# EasyEDA Pro project PicoMiteVGAV1.0.eprj, schematic Schematic1
Create Date: 2023-03-16; Page Name: P1; Project Name: PicoMiteVGAV1.0; Schematic Name: Schematic1; Update Date: 2023-04-25; Company: EasyEDA.com; Drawed: Peter Mather; Page Size: A4; Part Number: JLCPCB-002; Reviewed: Peter Mather; Version: V0.1
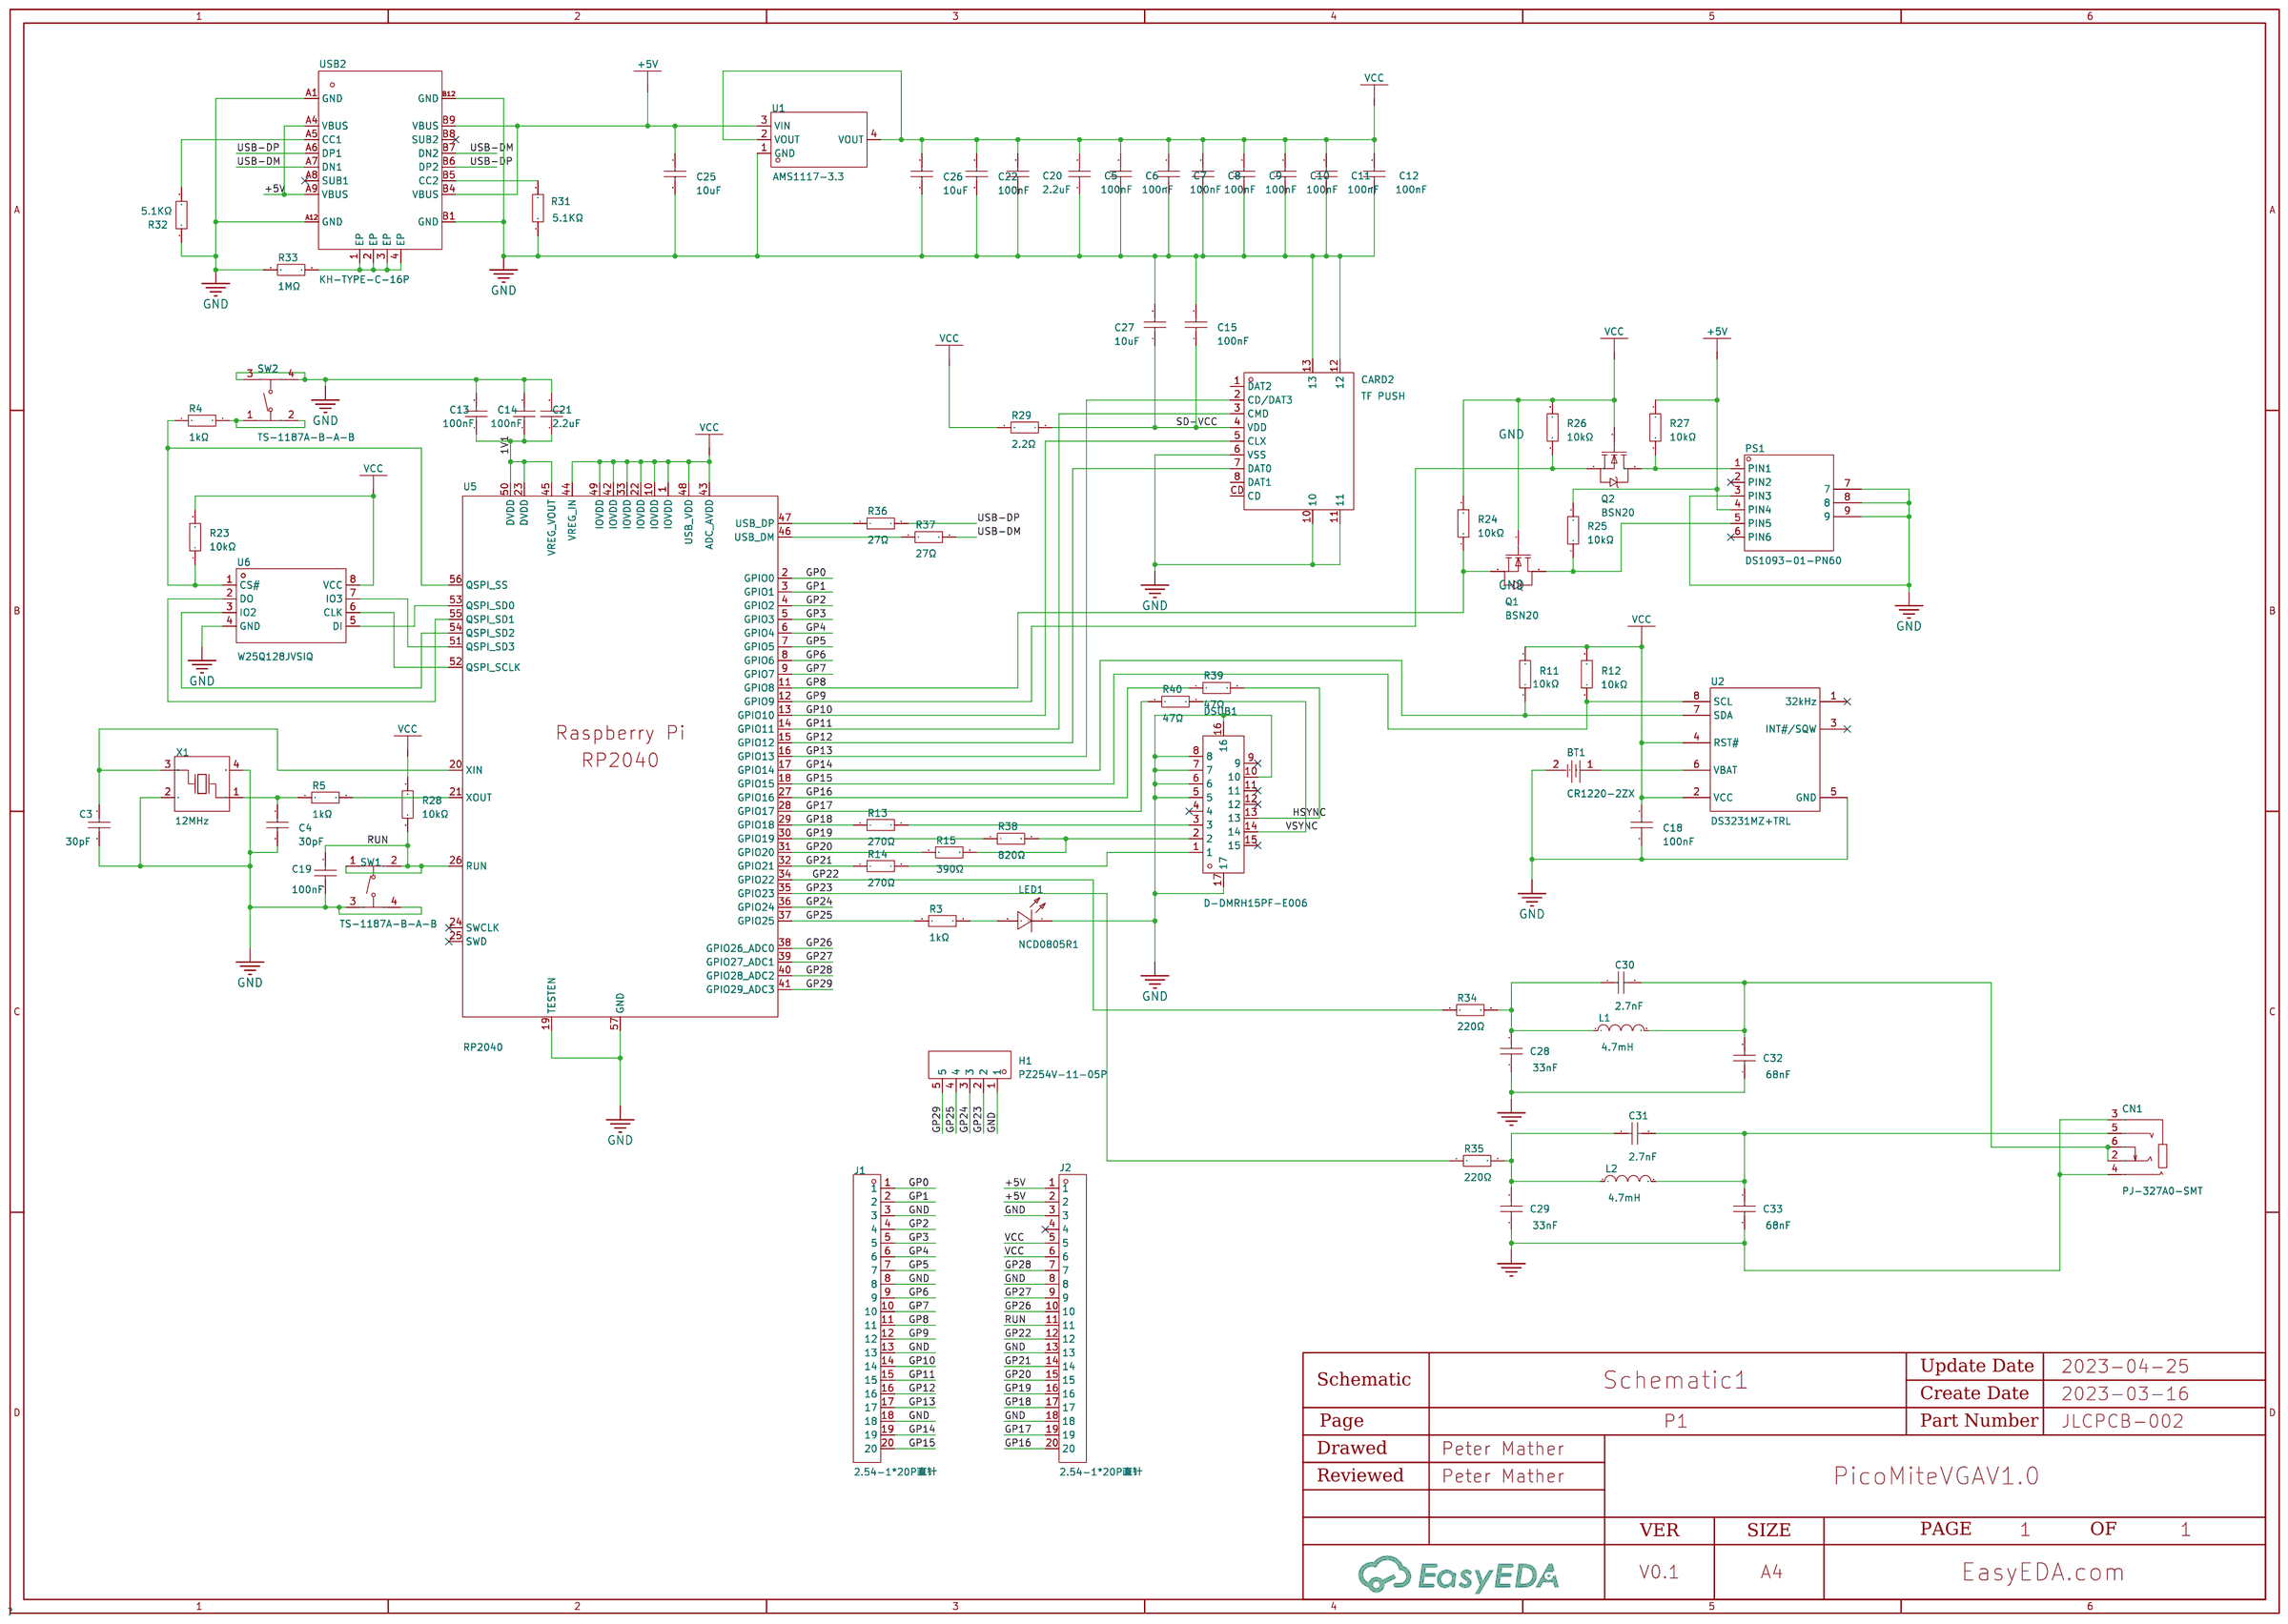
[diagram p0: schematic sheet]

## Parts
BT1  CR1220-2ZX  [BAT-SMD_CR1220-2ZX]
C3  30pF  [C0402]
C4  30pF  [C0402]
C5  100nF  [C0402_NEW]
C6  100nF  [C0402_NEW]
C7  100nF  [C0402_NEW]
C8  100nF  [C0402_NEW]
C9  100nF  [C0402_NEW]
C10  100nF  [C0402_NEW]
C11  100nF  [C0402_NEW]
C12  100nF  [C0402_NEW]
C13  100nF  [C0402_NEW]
C14  100nF  [C0402_NEW]
C15  100nF  [C0402_NEW]
C18  100nF  [C0402_NEW]
C19  100nF  [C0402_NEW]
C20  2.2uF  [C0603]
C21  2.2uF  [C0603]
C22  100nF  [C0402_NEW]
C25  10uF  [C1206]
C26  10uF  [C1206]
C27  10uF  [C1206]
C28  33nF  [C0603]
C29  33nF  [C0603]
C30  2.7nF  [C0603]
C31  2.7nF  [C0603]
C32  68nF  [C0603]
C33  68nF  [C0603]
CARD2  TF PUSH  [TF-SMD_TF-PUSH]
CN1  PJ-327A0-SMT  [AUDIO-SMD_PJ-327A0-SMT]
DSUB1  D-DMRH15PF-E006  [DSUB-TH_15P-P2.29-H-F_DDMRH15PFE006]
H1  PZ254V-11-05P  [HDR-TH_5P-P2.54-V-M]
J1  2.54-1*20P直针  [HDR-TH_20P-P2.54-V-M-1]
J2  2.54-1*20P直针  [HDR-TH_20P-P2.54-V-M-1]
L1  4.7mH  [IND-SMD_L6.0-W6.0]
L2  4.7mH  [IND-SMD_L6.0-W6.0]
LED1  NCD0805R1  [LED0805-RD]
PS1  DS1093-01-PN60  [CONN-TH_DS1093-01-PN60]
Q1  BSN20  [SOT-23-3_L2.9-W1.6-P1.90-LS2.8-BR]
Q2  BSN20  [SOT-23-3_L2.9-W1.6-P1.90-LS2.8-BR]
R3  1kΩ  [R0603]
R4  1kΩ  [R0603]
R5  1kΩ  [R0603]
R11  10kΩ  [R0805]
R12  10kΩ  [R0805]
R13  270Ω  [R0603]
R14  270Ω  [R0603]
R15  390Ω  [R0603]
R23  10kΩ  [R0402]
R24  10kΩ  [R0402]
R25  10kΩ  [R0402]
R26  10kΩ  [R0402]
R27  10kΩ  [R0402]
R28  10kΩ  [R0402]
R29  2.2Ω  [R0805]
R31  5.1kΩ  [R0402]
R32  5.1kΩ  [R0402]
R33  1MΩ  [R0402]
R34  220Ω  [R0603]
R35  220Ω  [R0603]
R36  27Ω  [R0603]
R37  27Ω  [R0603]
R38  820Ω  [R0603]
R39  47Ω  [R0805]
R40  47Ω  [R0805]
SW1  TS-1187A-B-A-B  [SW-SMD_4P-L5.1-W5.1-P3.70-LS6.5-TL-2]
SW2  TS-1187A-B-A-B  [SW-SMD_4P-L5.1-W5.1-P3.70-LS6.5-TL-2]
U1  AMS1117-3.3  [SOT-223-3_L6.5-W3.4-P2.30-LS7.0-BR]
U2  DS3231MZ+TRL  [SOIC-8_L4.9-W3.9-P1.27-LS6.0-BL]
U5  RP2040  [LQFN-56_L7.0-W7.0-P0.4-EP]
U6  W25Q128JVSIQ  [SOIC-8_L5.3-W5.3-P1.27-LS8.0-BL]
USB2  KH-TYPE-C-16P  [USB-C-SMD_KH-TYPE-C-16P]
X1  12MHz  [OSC-SMD_4P-L3.2-W2.5-BL]

## Library data of the parts
BT1 = CR1220-2ZX: Connector Type:Battery base Battery Type:CR1220 Operating Temperature Range:-25℃~+85℃ Operating Temperature Range:-25℃~+85℃; LCSC Part Name: 电池底座 适用电池:CR1220 自吸; Supplier Part: C969906; Manufacturer: Q&J; Supplier Footprint: SMD; JLCPCB Part Class: Extended Part; Datasheet: https://atta.szlcsc.com/upload/public/pdf/source/20210107/C969906_C1D85B5C66CBBA4D1AEB8467FE1CEC7A.pdf; Supplier: LCSC; Connector Type: Battery base; Battery Type: CR1220; Operating Temperature Range: -25℃~+85℃
C3 C4 = 0402CG300J500NT: Capacitance: Tolerance:±5% Tolerance:±5% Voltage Rated: Temperature Coefficient:; LCSC Part Name: 30pF ±5% 50V; Supplier Part: C1570; Manufacturer: FH(风华); Supplier Footprint: 0402; JLCPCB Part Class: Basic Part; Datasheet: https://atta.szlcsc.com/upload/public/pdf/source/20170923/C1570_1506149275948988377.pdf; Supplier: LCSC; Tolerance: ±5%
C5-C15 C18 C19 C22 = CL05B104KO5NNNC: Capacitance: Tolerance:±10% Tolerance:±10% Voltage Rated: Temperature Coefficient:; LCSC Part Name: 100nF ±10% 16V; Supplier Part: C1525; Manufacturer: SAMSUNG(三星); Supplier Footprint: 0402; JLCPCB Part Class: Basic Part; Datasheet: https://atta.szlcsc.com/upload/public/pdf/source/20160103/1457707674891.pdf; Supplier: LCSC; Tolerance: ±10%
C20 C21 = CL10A225KO8NNNC: Capacitance: Tolerance:±10% Tolerance:±10% Voltage Rated: Temperature Coefficient:; LCSC Part Name: 2.2uF ±10% 16V; Supplier Part: C23630; Manufacturer: SAMSUNG(三星); Supplier Footprint: 0603; JLCPCB Part Class: Basic Part; Datasheet: https://atta.szlcsc.com/upload/public/pdf/source/20160103/1457707709512.pdf; Supplier: LCSC; Tolerance: ±10%
C25-C27 = CL31A106KBHNNNE: Capacitance: Tolerance:±10% Tolerance:±10% Voltage Rated: Temperature Coefficient:; LCSC Part Name: 10uF ±10% 50V; Supplier Part: C13585; Manufacturer: SAMSUNG(三星); Supplier Footprint: 1206; JLCPCB Part Class: Basic Part; Datasheet: https://atta.szlcsc.com/upload/public/pdf/source/20160103/1457707668742.pdf; Supplier: LCSC; Tolerance: ±10%
C28 C29 = CL10B333KB8NNNC: Capacitance: Tolerance:±10% Tolerance:±10% Voltage Rated: Temperature Coefficient:; LCSC Part Name: 33nF ±10% 50V; Supplier Part: C21117; Manufacturer: SAMSUNG(三星); Supplier Footprint: 0603; JLCPCB Part Class: Basic Part; Datasheet: https://atta.szlcsc.com/upload/public/pdf/source/20160103/1457707704657.pdf; Supplier: LCSC; Tolerance: ±10%
C30 C31 = 0603B272K500NT: Capacitance: Tolerance:±10% Tolerance:±10% Voltage Rated: Temperature Coefficient:; LCSC Part Name: 2.7nF ±10% 50V; Supplier Part: C1609; Manufacturer: FH(风华); Supplier Footprint: 0603; JLCPCB Part Class: Basic Part; Datasheet: https://atta.szlcsc.com/upload/public/pdf/source/20170923/C1609_1506149290824988408.pdf; Supplier: LCSC; Tolerance: ±10%
C32 C33 = CL10B683KB8NNNC: Capacitance: Tolerance:±10% Tolerance:±10% Voltage Rated: Temperature Coefficient:; LCSC Part Name: 68nF ±10% 50V; Supplier Part: C31658; Manufacturer: SAMSUNG(三星); Supplier Footprint: 0603; JLCPCB Part Class: Basic Part; Datasheet: https://atta.szlcsc.com/upload/public/pdf/source/20160103/1457707721348.pdf; Supplier: LCSC; Tolerance: ±10%
CARD2 = TF PUSH: Card Type:MicroSD卡(TF卡) Connector Type:卡座 Card Connection Mode:自弹式 Maximum Body Height:2mm Operating Temperature Range:-20℃~+90℃ Operating Temperature Range:-20℃~+90℃; LCSC Part Name: 自弹式TF卡座 TF外焊式内存卡卡座; Supplier Part: C393941; Manufacturer: SHOU HAN(首韩); Supplier Footprint: SMD; JLCPCB Part Class: Extended Part; Datasheet: https://atta.szlcsc.com/upload/public/pdf/source/20191011/C393941_0DDD896EE907FEB750D8B7B8982E2A67.pdf; Supplier: LCSC; Card Type: MicroSD卡(TF卡); Connector Type: 卡座; Card Connection Mode: 自弹式; Maximum Body Height: 2mm; Operating Temperature Range: -20℃~+90℃
CN1 = PJ-327A0-SMT: Connector Type:3.5mm耳机座 Current Rating (Max):0.5A Voltage Rating (Max):30V Operating Temperature Range:-20℃~+70℃ Operating Temperature Range:-20℃~+70℃ Welding Temperature (Max):235℃; LCSC Part Name: 3.5mm耳机座 5P镀金; Supplier Part: C381135; Manufacturer: XKB Connectivity(中国星坤); Supplier Footprint: SMD; JLCPCB Part Class: Extended Part; Datasheet: https://atta.szlcsc.com/upload/public/pdf/source/20211011/16B83D74DCFBFB52BBA1016D248FDA16.pdf; Supplier: LCSC; Connector Type: 3.5mm耳机座; Current Rating (Max): 0.5A; Voltage Rating (Max): 30V; Operating Temperature Range: -20℃~+70℃; Welding Temperature (Max): 235℃
DSUB1 = D-DMRH15PF-E006: Connector Type:D-Sub Gender:Female Number of Pins:15 Number of Rows:3 Mounting Style:Shrouded Current Rating (Max):3A Operating Temperature Range:-50℃~+105℃ Operating Temperature Range:-50℃~+105℃; LCSC Part Name: D-Sub 母 P数:15 HDR半金 铆合锁螺丝 黑胶芯三排; Supplier Part: C379814; Manufacturer: Ckmtw(灿科盟); Supplier Footprint: 插件; JLCPCB Part Class: Extended Part; Datasheet: https://atta.szlcsc.com/upload/public/pdf/source/20190517/C379814_DEECC6016DAC8F179B4364792A838A7A.pdf; Supplier: LCSC; Connector Type: D-Sub; Gender: Female; Number of Pins: 15; Number of Rows: 3; Mounting Style: Shrouded; Current Rating (Max): 3A; Operating Temperature Range: -50℃~+105℃
H1 = PZ254V-11-05P: Number of Rows:单排 Number of Pins:5 Pitch:2.54mm Pin Structure:1x5P Row Spacing:- Mounting Type:Straight Circluar Pins/Square Pins:Square Pins Current Rating (Max):- Voltage Rating (Max):- Length of Mating Pin:6mm Insulation Height:2.5mm Length of End Conn; LCSC Part Name: 2.54mm 1x5P 直插 方针; Supplier Part: C492404; Manufacturer: XFCN(兴飞); Supplier Footprint: 插件,P=2.54mm; JLCPCB Part Class: Extended Part; Datasheet: https://atta.szlcsc.com/upload/public/pdf/source/20200309/C492404_E51533260F8710EFF5D4617281164C1D.pdf; Supplier: LCSC; Number of Rows: 单排; Number of Pins: 5; Pitch: 2.54mm; Pin Structure: 1x5P; Mounting Type: Straight; Circluar Pins/Square Pins: Square Pins; Length of Mating Pin: 6mm; Insulation Height: 2.5mm; Length of End Connection Pin: 3mm; Operating Temperature Range: -40℃~+105℃; Color: Black
J1 J2 = 2.54-1*20P直针: Number of Rows:单排 Number of Pins:20 Pitch:2.54mm Pin Structure:1x20P Row Spacing:- Mounting Type:Straight Circluar Pins/Square Pins:Square Pins Current Rating (Max):3A Voltage Rating (Max):- Length of Mating Pin:- Insulation Height:- Length of End Connect; LCSC Part Name: 2.54mm 1x20P 直插 方针; Supplier Part: C50981; Manufacturer: BOOMELE(博穆精密); Supplier Footprint: 插件,P=2.54mm; JLCPCB Part Class: Extended Part; Datasheet: https://atta.szlcsc.com/upload/public/pdf/source/20151109/1457707571495.pdf; Supplier: LCSC; Number of Rows: 单排; Number of Pins: 20; Pitch: 2.54mm; Pin Structure: 1x20P; Mounting Type: Straight; Circluar Pins/Square Pins: Square Pins; Current Rating (Max): 3A; Operating Temperature Range: -40℃~+105℃; Color: Black
L1 L2 = YNR6045-472M: Inductance: Tolerance: Tolerance: Rated Current: DC Resistance (DCR):; LCSC Part Name: 4.7mH ±20% 120mA 19.75Ω; Supplier Part: C497846; Manufacturer: YJYCOIN(益嘉源); Supplier Footprint: SMD,6x6mm; JLCPCB Part Class: Extended Part; Datasheet: https://atta.szlcsc.com/upload/public/pdf/source/20200317/C497838_ADAADDA66AFC043F2D8B9A62FB946728.pdf; Supplier: LCSC
LED1 = NCD0805R1_C84256: Emitted Color:红灯; LCSC Part Name: 红灯; Supplier Part: C84256; Manufacturer: 国星光电; Supplier Footprint: 0805; JLCPCB Part Class: Basic Part; Datasheet: https://atta.szlcsc.com/upload/public/pdf/source/20200820/C84256_F0A75A43B3EAD75808600A0514C76B99.pdf; Supplier: LCSC; Emitted Color: 红灯
PS1 = DS1093-01-PN60: Number of Pins:6 Gender:Female Level of Protection:- Current Rating (Max):1A Operating Temperature Range:-40℃~+105℃ Operating Temperature Range:-40℃~+105℃; LCSC Part Name: PS2鼠标插座 6Pin  紫色; Supplier Part: C77848; Manufacturer: CONNFLY; Supplier Footprint: 插件; JLCPCB Part Class: Extended Part; Datasheet: https://atta.szlcsc.com/upload/public/pdf/source/20160816/1471343007546.pdf; Supplier: LCSC; Number of Pins: 6; Gender: Female; Current Rating (Max): 1A; Operating Temperature Range: -40℃~+105℃
Q1 Q2 = BSN20_C116157: Type: Drain Source Voltage (Vdss): Continuous Drain Current (Id): Power Dissipation (Pd):- Drain Source On Resistance (RDS(on)@Vgs,Id):3.5Ω@5V,200mA Gate Threshold Voltage (Vgs(th)@Id):1.5V@1mA; LCSC Part Name: N沟道 50V 100mA; Supplier Part: C116157; Manufacturer: SHIKUES(时科); Supplier Footprint: SOT-23-3L; JLCPCB Part Class: Extended Part; Datasheet: https://atta.szlcsc.com/upload/public/pdf/source/20170721/C116157_1500622630262834583.pdf; Supplier: LCSC; Drain Source On Resistance (RDS(on)@Vgs,Id): 3.5Ω@5V,200mA; Gate Threshold Voltage (Vgs(th)@Id): 1.5V@1mA
R3-R5 = 0603WAF1001T5E: Type:Thick Film Resistors Resistance: Tolerance:±1% Tolerance:±1% Power(Watts): Temperature Coefficient:±100ppm/℃ Temperature Coefficient:±100ppm/℃ Overload Voltage (Max): Operating Temperature Range:-55℃~+155℃ Operating Temperature Range:-55℃~+155℃; LCSC Part Name: 1kΩ ±1% 100mW; Supplier Part: C21190; Manufacturer: UNI-ROYAL(厚声); Supplier Footprint: 0603; JLCPCB Part Class: Basic Part; Datasheet: https://atta.szlcsc.com/upload/public/pdf/source/20200306/C422600_1E6D84923E4A46A82E41ADD87F860B5C.pdf; Supplier: LCSC; Type: Thick Film Resistors; Tolerance: ±1%; Temperature Coefficient: ±100ppm/℃; Operating Temperature Range: -55℃~+155℃
R11 R12 = 0805W8F1002T5E: Type:Thick Film Resistors Resistance: Tolerance:±1% Tolerance:±1% Power(Watts): Temperature Coefficient:±100ppm/℃ Temperature Coefficient:±100ppm/℃ Overload Voltage (Max): Operating Temperature Range:-55℃~+155℃ Operating Temperature Range:-55℃~+155℃; LCSC Part Name: 10kΩ ±1% 125mW; Supplier Part: C17414; Manufacturer: UNI-ROYAL(厚声); Supplier Footprint: 0805; JLCPCB Part Class: Basic Part; Datasheet: https://atta.szlcsc.com/upload/public/pdf/source/20200306/C422600_1E6D84923E4A46A82E41ADD87F860B5C.pdf; Supplier: LCSC; Type: Thick Film Resistors; Tolerance: ±1%; Temperature Coefficient: ±100ppm/℃; Operating Temperature Range: -55℃~+155℃
R13 R14 = 0603WAF2700T5E: Type:Thick Film Resistors Resistance: Tolerance:±1% Tolerance:±1% Power(Watts): Temperature Coefficient:±100ppm/℃ Temperature Coefficient:±100ppm/℃ Overload Voltage (Max): Operating Temperature Range:-55℃~+155℃ Operating Temperature Range:-55℃~+155℃; LCSC Part Name: 270Ω ±1% 100mW; Supplier Part: C22966; Manufacturer: UNI-ROYAL(厚声); Supplier Footprint: 0603; JLCPCB Part Class: Basic Part; Datasheet: https://atta.szlcsc.com/upload/public/pdf/source/20200306/C422600_1E6D84923E4A46A82E41ADD87F860B5C.pdf; Supplier: LCSC; Type: Thick Film Resistors; Tolerance: ±1%; Temperature Coefficient: ±100ppm/℃; Operating Temperature Range: -55℃~+155℃
R15 = 0603WAF3900T5E: Tolerance: Temperature Coefficient: Temperature Coefficient: Power(Watts): Resistance: Overload Voltage (Max): Operating Temperature Range: Operating Temperature Range:; LCSC Part Name: 390Ω ±1%; Supplier Part: C23151; Manufacturer: UNI-ROYAL(厚声); Supplier Footprint: 0603; JLCPCB Part Class: Basic Part; Datasheet: https://atta.szlcsc.com/upload/public/pdf/source/20170920/C23151_1505901103965982535.pdf; Supplier: LCSC
R23-R28 = 0402WGF1002TCE: Type:Thick Film Resistors Resistance: Tolerance:±1% Tolerance:±1% Power(Watts): Temperature Coefficient:±100ppm/℃ Temperature Coefficient:±100ppm/℃ Overload Voltage (Max): Operating Temperature Range:-55℃~+155℃ Operating Temperature Range:-55℃~+155℃; LCSC Part Name: 10kΩ ±1% 62.5mW; Supplier Part: C25744; Manufacturer: UNI-ROYAL(厚声); Supplier Footprint: 0402; JLCPCB Part Class: Basic Part; Datasheet: https://atta.szlcsc.com/upload/public/pdf/source/20200306/C422600_1E6D84923E4A46A82E41ADD87F860B5C.pdf; Supplier: LCSC; Type: Thick Film Resistors; Tolerance: ±1%; Temperature Coefficient: ±100ppm/℃; Operating Temperature Range: -55℃~+155℃
R29 = 0805W8F220KT5E: LCSC Part Name: 2.2Ω(2R20) ±1% 编带; Supplier Part: C17521; Manufacturer: UNI-ROYAL(厚声); Supplier Footprint: 0805; JLCPCB Part Class: Basic Part; Datasheet: https://atta.szlcsc.com/upload/public/pdf/source/20170920/C17521_1505887118343979880.pdf; Supplier: LCSC
R31 R32 = 0402WGF5101TCE: Type:Thick Film Resistors Resistance: Tolerance:±1% Tolerance:±1% Power(Watts): Temperature Coefficient:±100ppm/℃ Temperature Coefficient:±100ppm/℃ Overload Voltage (Max): Operating Temperature Range:-55℃~+155℃ Operating Temperature Range:-55℃~+155℃; LCSC Part Name: 5.1KΩ(5101) ±1% 编带; Supplier Part: C25905; Manufacturer: UNI-ROYAL(厚声); Manufacturer Part: 5.1KΩ; Supplier Footprint: 0402; JLCPCB Part Class: Basic Part; Datasheet: https://atta.szlcsc.com/upload/public/pdf/source/20170920/C25905_1505895107382980911.pdf; Supplier: LCSC; Type: Thick Film Resistors; Tolerance: ±1%; Temperature Coefficient: ±100ppm/℃; Operating Temperature Range: -55℃~+155℃
R33 = 0402WGF1004TCE: Type:Thick Film Resistors Resistance: Tolerance:±1% Tolerance:±1% Power(Watts): Temperature Coefficient:±100ppm/℃ Temperature Coefficient:±100ppm/℃ Overload Voltage (Max): Operating Temperature Range:-55℃~+155℃ Operating Temperature Range:-55℃~+155℃; LCSC Part Name: 1MΩ ±1% 62.5mW; Supplier Part: C26083; Manufacturer: UNI-ROYAL(厚声); Supplier Footprint: 0402; JLCPCB Part Class: Basic Part; Datasheet: https://atta.szlcsc.com/upload/public/pdf/source/20200306/C422600_1E6D84923E4A46A82E41ADD87F860B5C.pdf; Supplier: LCSC; Type: Thick Film Resistors; Tolerance: ±1%; Temperature Coefficient: ±100ppm/℃; Operating Temperature Range: -55℃~+155℃
R34 R35 = 0603WAF2200T5E: Type:Thick Film Resistors Resistance: Tolerance:±1% Tolerance:±1% Power(Watts): Temperature Coefficient:±100ppm/℃ Temperature Coefficient:±100ppm/℃ Overload Voltage (Max): Operating Temperature Range:-55℃~+155℃ Operating Temperature Range:-55℃~+155℃; LCSC Part Name: 220Ω ±1% 100mW; Supplier Part: C22962; Manufacturer: UNI-ROYAL(厚声); Supplier Footprint: 0603; JLCPCB Part Class: Basic Part; Datasheet: https://atta.szlcsc.com/upload/public/pdf/source/20200306/C422600_1E6D84923E4A46A82E41ADD87F860B5C.pdf; Supplier: LCSC; Type: Thick Film Resistors; Tolerance: ±1%; Temperature Coefficient: ±100ppm/℃; Operating Temperature Range: -55℃~+155℃
R36 R37 = 0603WAF270JT5E: Type:Thick Film Resistors Resistance: Tolerance:±1% Tolerance:±1% Power(Watts): Temperature Coefficient:±200ppm/℃ Temperature Coefficient:±200ppm/℃ Overload Voltage (Max): Operating Temperature Range:-55℃~+155℃ Operating Temperature Range:-55℃~+155℃; LCSC Part Name: 27Ω ±1% 100mW; Supplier Part: C25190; Manufacturer: UNI-ROYAL(厚声); Supplier Footprint: 0603; JLCPCB Part Class: Basic Part; Datasheet: https://atta.szlcsc.com/upload/public/pdf/source/20200306/C422600_1E6D84923E4A46A82E41ADD87F860B5C.pdf; Supplier: LCSC; Type: Thick Film Resistors; Tolerance: ±1%; Temperature Coefficient: ±200ppm/℃; Operating Temperature Range: -55℃~+155℃
R38 = 0603WAF8200T5E: Type:Thick Film Resistors Resistance: Tolerance:±1% Tolerance:±1% Power(Watts): Temperature Coefficient:±100ppm/℃ Temperature Coefficient:±100ppm/℃ Overload Voltage (Max): Operating Temperature Range:-55℃~+155℃ Operating Temperature Range:-55℃~+155℃; LCSC Part Name: 820Ω ±1% 100mW; Supplier Part: C23253; Manufacturer: UNI-ROYAL(厚声); Supplier Footprint: 0603; JLCPCB Part Class: Basic Part; Datasheet: https://atta.szlcsc.com/upload/public/pdf/source/20200306/C422600_1E6D84923E4A46A82E41ADD87F860B5C.pdf; Supplier: LCSC; Type: Thick Film Resistors; Tolerance: ±1%; Temperature Coefficient: ±100ppm/℃; Operating Temperature Range: -55℃~+155℃
R39 R40 = 0805W8F470JT5E: Type:Thick Film Resistors Resistance: Tolerance:±1% Tolerance:±1% Power(Watts): Temperature Coefficient:±200ppm/℃ Temperature Coefficient:±200ppm/℃ Overload Voltage (Max): Operating Temperature Range:-55℃~+155℃ Operating Temperature Range:-55℃~+155℃; LCSC Part Name: 47Ω ±1% 125mW; Supplier Part: C17714; Manufacturer: UNI-ROYAL(厚声); Supplier Footprint: 0805; JLCPCB Part Class: Basic Part; Datasheet: https://atta.szlcsc.com/upload/public/pdf/source/20200306/C422600_1E6D84923E4A46A82E41ADD87F860B5C.pdf; Supplier: LCSC; Type: Thick Film Resistors; Tolerance: ±1%; Temperature Coefficient: ±200ppm/℃; Operating Temperature Range: -55℃~+155℃
SW1 SW2 = TS-1187A-B-A-B: Contact Current:50mA Voltage Rating (DC):12V Insulation Resistance:- Circuit:SPST Mounting Style:Brick nogging Actuator Style:Round Button Actuator/Cap Color:金色 With Lamp:No Operating Force:160gf Mechanical Life:100000 Operating Temperature:-30℃~+85℃ Oper; LCSC Part Name: 5.1*5.1*1.5 防水金属头160gf; Supplier Part: C318884; Manufacturer: XKB Connectivity(中国星坤); Supplier Footprint: SMD; JLCPCB Part Class: Basic Part; Datasheet: https://atta.szlcsc.com/upload/public/pdf/source/20200227/C318884_1F20165719E1C4CAA3E10C4C359C6E26.pdf; Supplier: LCSC; Contact Current: 50mA; Voltage Rating (DC): 12V; Circuit: SPST; Mounting Style: Brick nogging; Actuator Style: Round Button; Actuator/Cap Color: 金色; With Lamp: No; Operating Force: 160gf; Mechanical Life: 100000; Operating Temperature: -30℃~+85℃; Switch Length: 5.1mm; Switch Width: 5.1mm; Switch Height: 1.5mm; Strike Gundam: NO
U1 = AMS1117-3.3_C6186: Output Type: Output Polarity:Positive Number of Outputs:1 Maximum Input Voltage:- Output Voltage:3.3V~3.3V Output Voltage:3.3V~3.3V Dropout Voltage:1.3V@(800mA) Quiescent Current (Ground Current):- Output Current:1A Power Supply Rejection Ratio (PSRR):72d; LCSC Part Name: 正 Vout=3.3V 1A 72dB@(120Hz); Supplier Part: C6186; Manufacturer: AMS; Supplier Footprint: SOT-223-3; JLCPCB Part Class: Basic Part; Datasheet: https://atta.szlcsc.com/upload/public/pdf/source/20180727/C6186_7A095716F0823C02F1997A905E26C086.pdf; Supplier: LCSC; Output Polarity: Positive; Number of Outputs: 1; Output Voltage: 3.3V~3.3V; Dropout Voltage: 1.3V@(800mA); Output Current: 1A; Power Supply Rejection Ratio (PSRR): 72dB@(120Hz)
U2 = DS3231MZ+TRL: LCSC Part Name: DS3231MZRL; Supplier Part: C107410; Manufacturer: MAXIM(美信); Supplier Footprint: SOIC-8-150mil; JLCPCB Part Class: Extended Part; Datasheet: https://atta.szlcsc.com/upload/public/pdf/source/20170620/1497944726830.pdf; Supplier: LCSC
U5 = RP2040_C2040: CPU Core:ARM Cortex-M0 CPU Maximum Speed:133MHz Operating Voltage Range:- Operating Voltage Range:- Program Storage Size:- Program Memory Type:- RAM Size:264KB EEPROM:- GPIO Ports Number:30 ADC (Bit):12bit DAC (Bit):- PWM (Bit):- 8Bit Timer:- 16Bit Timer:; LCSC Part Name: ARM Cortex-M0 133MHz; Supplier Part: C2040; Manufacturer: Raspberry Pi(树莓派); Supplier Footprint: LQFN-56(7x7); JLCPCB Part Class: Extended Part; Datasheet: https://atta.szlcsc.com/upload/public/pdf/source/20210621/C2040_96F425825606B7957D87DD32E2512CA9.pdf; Supplier: LCSC; CPU Core: ARM Cortex-M0; CPU Maximum Speed: 133MHz; RAM Size: 264KB; GPIO Ports Number: 30; ADC (Bit): 12bit; UART/USART: 2; I2C: 2; SPI: 2; Universal Serial Bus: 有; Peripheral/Function: DMA；PWM; Direct Memory Access: 有
U6 = W25Q128JVSIQ: Supplier Part: C97521; Manufacturer: WINBOND(华邦); Supplier Footprint: SOIC-8-208mil; JLCPCB Part Class: Basic Part; Datasheet: https://atta.szlcsc.com/upload/public/pdf/source/20170316/1489627409956.pdf; Supplier: LCSC
USB2 = KH-TYPE-C-16P: Connector Type:Type-C Standard:- Gender:Female Number of Contacts:16 Number of Ports:1 Mounting Style:Surface Mount Current Rating - Power (Max):3A Operating Temperature Range:-40℃~+85℃ Operating Temperature Range:-40℃~+85℃; LCSC Part Name: Type-C 母座 卧贴; Supplier Part: C709357; Manufacturer: kinghelm(金航标); Supplier Footprint: SMD; JLCPCB Part Class: Extended Part; Datasheet: https://atta.szlcsc.com/upload/public/pdf/source/20200911/C709357_AA8DCEB38BB20E3035A7ED7AE7667837.pdf; Supplier: LCSC; Connector Type: Type-C; Gender: Female; Number of Contacts: 16; Number of Ports: 1; Mounting Style: Surface Mount; Current Rating - Power (Max): 3A; Operating Temperature Range: -40℃~+85℃
X1 = X322512MSB4SI: Crystal Type:SMD Crystal Resonator Frequency: Frequency Tolerance:±10ppm Frequency Tolerance:±10ppm Frequency Stability:±30ppm Frequency Stability:±30ppm Load Capacitance: Operating Temperature: Operating Temperature:; LCSC Part Name: 12MHz ±10ppm 20pF; Supplier Part: C9002; Manufacturer: YXC(扬兴晶振); Supplier Footprint: SMD3225-4P; JLCPCB Part Class: Basic Part; Datasheet: https://atta.szlcsc.com/upload/public/pdf/source/20210329/C112971_1F611BDC486E193C1706F6D8EB5AA189.pdf; Supplier: LCSC; Crystal Type: SMD Crystal Resonator; Frequency Tolerance: ±10ppm; Frequency Stability: ±30ppm

## Nets
1V1: C13.1 C14.1 C21.1 U5.23(DVDD) U5.45(VREG_VOUT) U5.50(DVDD)
+5V: C25.2 J2.1 J2.2 PS1.4(PIN4) R25.2 R27.2 U1.3(VIN) USB2.A4(VBUS) USB2.A9(VBUS) USB2.B4(VBUS) USB2.B9(VBUS)
GND: BT1.2 C3.1 C4.1 C5.1 C6.1 C7.1 C8.1 C9.1 C10.1 C11.1 C12.1 C13.2 C14.2 C15.2 C18.1 C19.1 C20.1 C21.2 C22.1 C25.1 C26.1 C27.2 C28.1 C29.1 C32.1 C33.1 CARD2.6(VSS) CARD2.10 CARD2.11 CARD2.12 CARD2.13 CN1.3 CN1.4 DSUB1.5 DSUB1.6 DSUB1.7 DSUB1.8 DSUB1.10 DSUB1.16 DSUB1.17 H1.1 J1.3 J1.8 J1.13 J1.18 J2.3 J2.8 J2.13 J2.18 LED1.1(-) PS1.3(PIN3) PS1.7 PS1.8 PS1.9 R31.1 R32.1 R33.1 SW1.3(C) SW1.4(D) SW2.3(C) SW2.4(D) U1.1(GND) U2.5(GND) U5.19(TESTEN) U5.57(GND) U6.4(GND) USB2.A1(GND) USB2.A12(GND) USB2.B1(GND) USB2.B12(GND) X1.2(GND) X1.4(GND)
VCC: C5.2 C6.2 C7.2 C8.2 C9.2 C10.2 C11.2 C12.2 C18.2 C20.2 C22.2 C26.2 J2.5 J2.6 Q1.1(G) Q2.1(G) R11.2 R12.2 R23.2 R24.2 R26.2 R28.2 R29.1 U1.2(VOUT) U1.4(VOUT) U2.2(VCC) U2.4(RST#) U5.1(IOVDD) U5.10(IOVDD) U5.22(IOVDD) U5.33(IOVDD) U5.42(IOVDD) U5.43(ADC_AVDD) U5.44(VREG_IN) U5.48(USB_VDD) U5.49(IOVDD) U6.8(VCC)
GP0: J1.1 U5.2(GPIO0)
GP1: J1.2 U5.3(GPIO1)
GP2: J1.4 U5.4(GPIO2)
GP3: J1.5 U5.5(GPIO3)
GP4: J1.6 U5.6(GPIO4)
GP5: J1.7 U5.7(GPIO5)
GP6: J1.9 U5.8(GPIO6)
GP7: J1.10 U5.9(GPIO7)
GP8: J1.11 Q1.2(S) R24.1 U5.11(GPIO8)
GP9: J1.12 Q2.2(S) R26.1 U5.12(GPIO9)
GP10: CARD2.5(CLX) J1.14 U5.13(GPIO10)
GP11: CARD2.3(CMD) J1.15 U5.14(GPIO11)
GP12: CARD2.7(DAT0) J1.16 U5.15(GPIO12)
GP13: CARD2.2(CD/DAT3) J1.17 U5.16(GPIO13)
GP14: J1.19 R11.1 U2.7(SDA) U5.17(GPIO14)
GP15: J1.20 R12.1 U2.8(SCL) U5.18(GPIO15)
GP16: J2.20 R39.1 U5.27(GPIO16)
GP17: J2.19 R40.1 U5.28(GPIO17)
GP18: J2.17 R13.1 U5.29(GPIO18)
GP19: J2.16 R38.1 U5.30(GPIO19)
GP20: J2.15 R15.1 U5.31(GPIO20)
GP21: J2.14 R14.1 U5.32(GPIO21)
GP22: J2.12 R34.1 U5.34(GPIO22)
GP23: H1.2 R35.1 U5.35(GPIO23)
GP24: H1.3 U5.36(GPIO24)
GP25: H1.4 R3.1 U5.37(GPIO25)
GP26: J2.10 U5.38(GPIO26_ADC0)
GP27: J2.9 U5.39(GPIO27_ADC1)
GP28: J2.7 U5.40(GPIO28_ADC2)
GP29: H1.5 U5.41(GPIO29_ADC3)
HSYNC: DSUB1.13 R39.2
RUN: C19.2 J2.11 R28.1 SW1.1(A) SW1.2(B) U5.26(RUN)
SD-VCC: C15.1 C27.1 CARD2.4(VDD) R29.2
USB-DM: R37.2 USB2.A7(DN1) USB2.B7(DN2)
USB-DP: R36.2 USB2.A6(DP1) USB2.B6(DP2)
VSYNC: DSUB1.14 R40.2
$1N15506: R37.1 U5.46(USB_DM)
$1N15528: R36.1 U5.47(USB_DP)
$1N16226: DSUB1.2 R15.2 R38.2
$1N16303: DSUB1.3 R13.2
$1N16324: DSUB1.1 R14.2
$1N17160: U5.52(QSPI_SCLK) U6.6(CLK)
$1N17190: U5.51(QSPI_SD3) U6.7(IO3)
$1N17220: U5.54(QSPI_SD2) U6.3(IO2)
$1N17286: U5.55(QSPI_SD1) U6.2(DO)
$1N17350: R4.1 R23.1 U5.56(QSPI_SS) U6.1(CS#)
$1N17556: U5.53(QSPI_SD0) U6.5(DI)
$1N17761: R5.2 U5.21(XOUT)
$1N17798: C4.2 R5.1 X1.1(OSC1)
$1N18648: C3.2 U5.20(XIN) X1.3(OSC2)
$1N19413: R4.2 SW2.1(A) SW2.2(B)
$1N20967: PS1.1(PIN1) Q2.3(D) R27.1
$1N21008: PS1.5(PIN5) Q1.3(D) R25.1
$1N25166: LED1.2(+) R3.2
$1N34038: BT1.1 U2.6(VBAT)
$1N89274: R31.2 USB2.B5(CC2)
$1N89558: R32.2 USB2.A5(CC1)
$1N90266: R33.2 USB2.1(EP) USB2.2(EP) USB2.3(EP) USB2.4(EP)
$1N123261: C28.2 C30.1 L1.1 R34.2
$1N123370: C29.2 C31.1 L2.1 R35.2
$1N128203: C30.2 C32.2 CN1.2 CN1.6 L1.2
$1N128821: C31.2 C33.2 CN1.5 L2.2

Not connected (* = marked no-connect by the designer): CARD2 1(DAT2) 8(DAT1) CD; DSUB1 4* 9* 11* 12* 15*; J2 4*; PS1 2(PIN2)* 6(PIN6)*; U2 1(32kHz)* 3(INT#/SQW)*; U5 24(SWCLK)* 25(SWD)*; USB2 A8(SUB1)* B8(SUB2)*
